# EAGLE design Arduino_MEGA_2560-Rev3 (EAGLE 6.5.0)
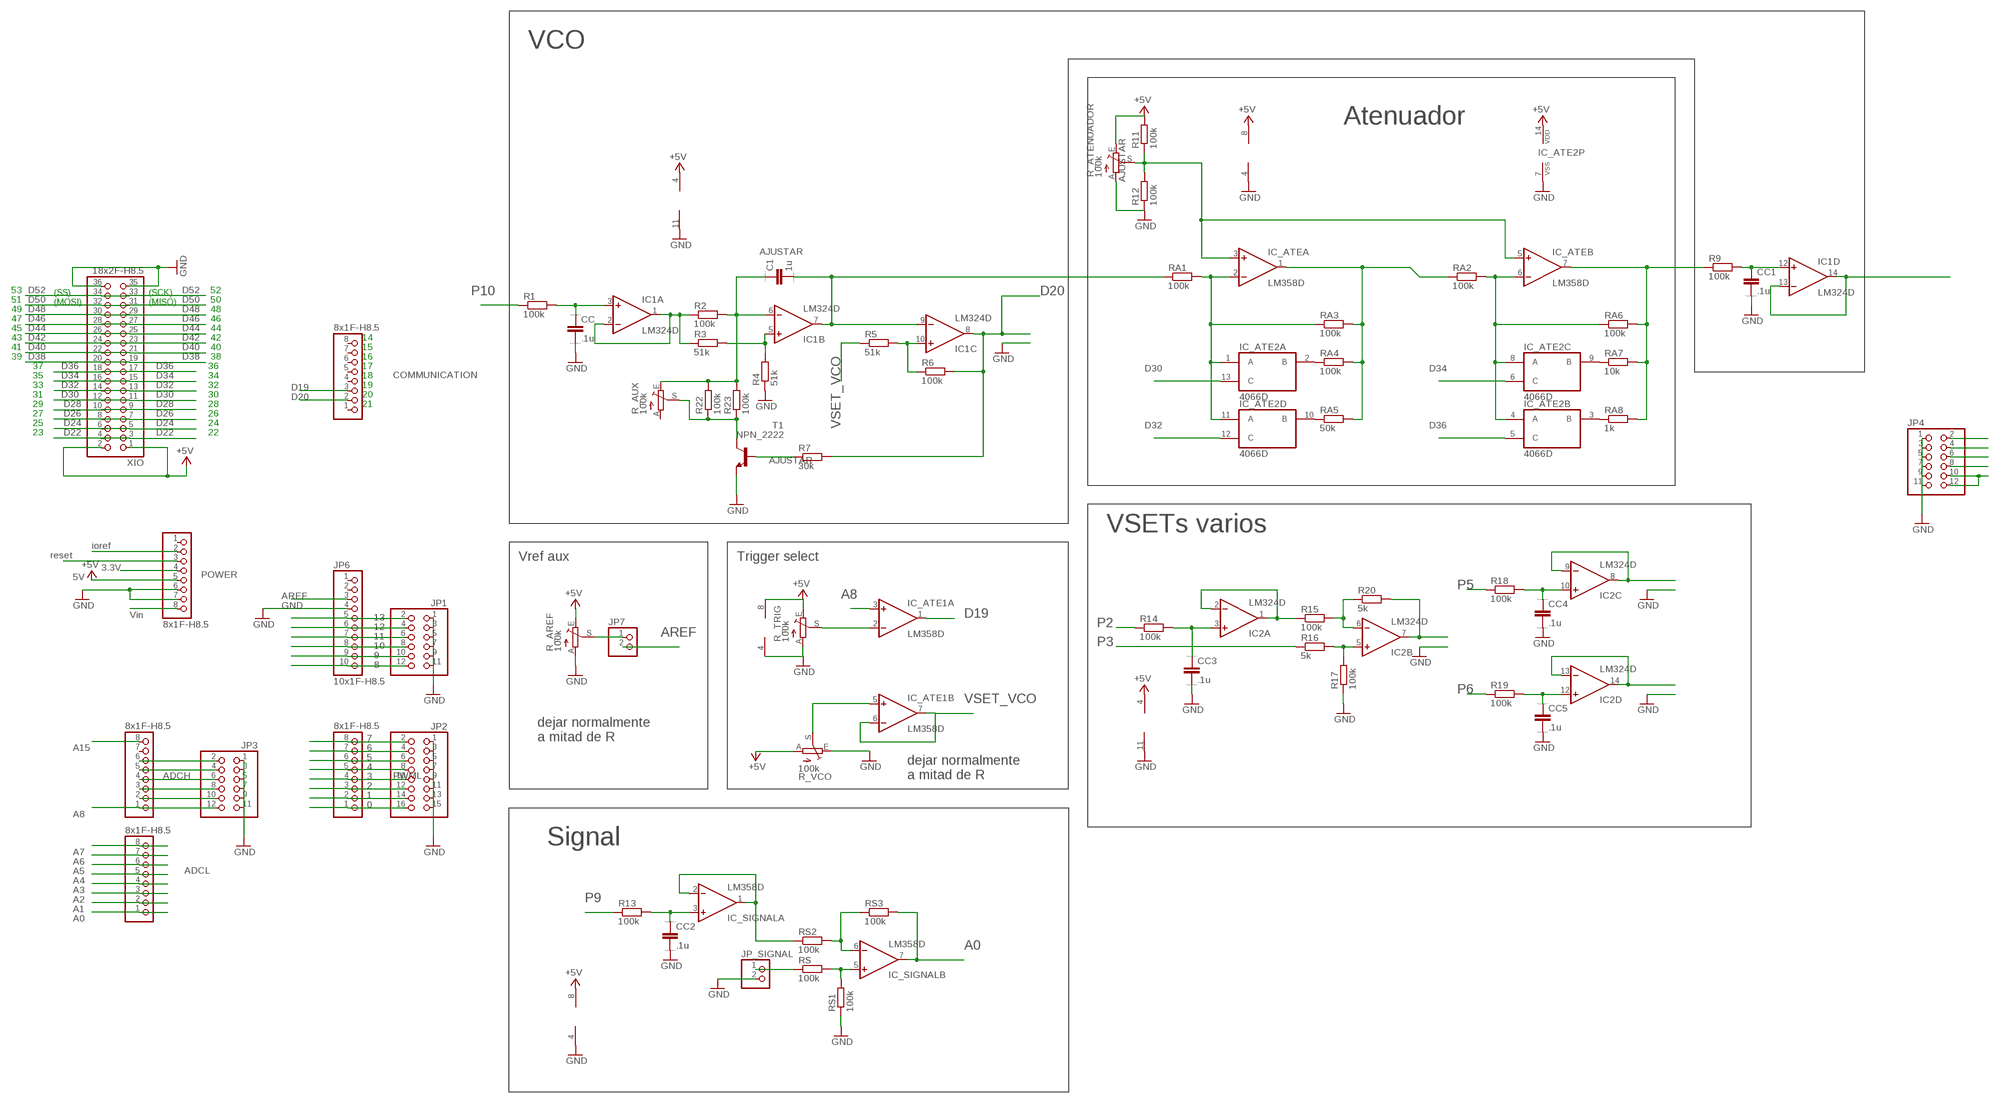
[diagram p0: schematic, sheet 1]

## Parts
ADCH  8x1F-H8.5  PINHD-1X8  [1X08]
ADCL  8x1F-H8.5  PINHD-1X8  [1X08]
C1  1u  CC1812  [C1812]
CC  .1u  CC1812  [C1812]
CC1  .1u  CC1812  [C1812]
CC2  .1u  CC1812  [C1812]
CC3  .1u  CC1812  [C1812]
CC4  .1u  CC1812  [C1812]
CC5  .1u  CC1812  [C1812]
COMMUNICATION  8x1F-H8.5  PINHD-1X8  [1X08]
IC1  LM324D  [SO14]
IC2  LM324D  [SO14]
IC_ATE  LM358D  [SO08]
IC_ATE1  LM358D  [SO08]
IC_ATE2  4066D  [SO14]
IC_SIGNAL  LM358D  [SO08]
JP1  PINHD-2X6  [2X06]
JP2  PINHD-2X8  [2X08]
JP3  PINHD-2X6  [2X06]
JP4  PINHD-2X6  [2X06]
JP6  10x1F-H8.5  PINHD-1X10_ARD  [1X10]
JP7  PINHD-1X2  [1X02]
JP_SIGNAL  PINHD-1X2  [1X02]
POWER  8x1F-H8.5  PINHD-1X8  [1X08]
PWML  8x1F-H8.5  PINHD-1X8  [1X08]
R1  100k  R-EU_R1206  [R1206]
R2  100k  R-EU_R1206  [R1206]
R3  51k  R-EU_R1206  [R1206]
R4  51k  R-EU_R1206  [R1206]
R5  51k  R-EU_R1206  [R1206]
R6  100k  R-EU_R1206  [R1206]
R7  30k  R-EU_0204/7  [0204/7]
R9  100k  R-EU_R1206  [R1206]
R11  100k  R-EU_R1206  [R1206]
R12  100k  R-EU_R1206  [R1206]
R13  100k  R-EU_R1206  [R1206]
R14  100k  R-EU_R1206  [R1206]
R15  100k  R-EU_R1206  [R1206]
R16  5k  R-EU_R1206  [R1206]
R17  100k  R-EU_R1206  [R1206]
R18  100k  R-EU_R1206  [R1206]
R19  100k  R-EU_R1206  [R1206]
R20  5k  R-EU_R1206  [R1206]
R22  100k  R-EU_R1206  [R1206]
R23  100k  R-EU_R1206  [R1206]
R_AREF  100k  TRIM_EU-B64Y  [B64Y]
R_ATENUADOR  100k  TRIM_EU-B64Y  [B64Y]
R_AUX  100k  TRIM_EU-B64Y  [B64Y]
R_TRIG  100k  TRIM_EU-B64Y  [B64Y]
R_VCO  100k  TRIM_EU-B64Y  [B64Y]
RA1  100k  R-EU_R1206  [R1206]
RA2  100k  R-EU_R1206  [R1206]
RA3  100k  R-EU_R1206  [R1206]
RA4  100k  R-EU_R1206  [R1206]
RA5  50k  R-EU_R1206  [R1206]
RA6  100k  R-EU_R1206  [R1206]
RA7  10k  R-EU_0204/7  [0204/7]
RA8  1k  R-EU_0204/7  [0204/7]
RS  100k  R-EU_R1206  [R1206]
RS1  100k  R-EU_R1206  [R1206]
RS2  100k  R-EU_R1206  [R1206]
RS3  100k  R-EU_R1206  [R1206]
T1  NPN_2222  NPN_SUP  [TO19_SUP]
XIO  18x2F-H8.5  PINHD-2X18  [2X18]

## Nets
3V3: POWER.4
+5V [power usb]: IC1.4(P:V+) IC2.4(P:V+) IC_ATE1.8(P:V+) IC_ATE2.14(P:VDD) IC_ATE.8(P:V+) IC_SIGNAL.8(P:V+) POWER.5 R11.2 R_AREF.E R_ATENUADOR.E R_TRIG.E R_VCO.A XIO.1 XIO.2
A0: ADCL.1 IC_SIGNAL.7(B:OUT) RS3.2
A1: ADCL.2
A2: ADCL.3
A3: ADCL.4
A4: ADCL.5
A5: ADCL.6
A6: ADCL.7
A7: ADCL.8
A8: ADCH.1 IC_ATE1.3(A:+IN) JP3.12
A9: ADCH.2 JP3.10
A9BIS: IC_ATE1.5(B:+IN) R_VCO.S
A10: ADCH.3 JP3.8
A11: ADCH.4 JP3.6
A12: ADCH.5 JP3.4
A13: ADCH.6 JP3.2
A15: ADCH.8
AREF: JP6.3 JP7.2
D19: COMMUNICATION.3 IC_ATE1.1(A:OUT)
D20: COMMUNICATION.2 IC1.8(C:OUT) JP4.2 R6.2 R7.2
D22: XIO.3 XIO.4
D24: XIO.5 XIO.6
D26: XIO.7 XIO.8
D28: XIO.9 XIO.10
D30: IC_ATE2.13(A:C) XIO.11 XIO.12
D32: IC_ATE2.12(D:C) XIO.13 XIO.14
D34: IC_ATE2.6(C:C) XIO.15 XIO.16
D36: IC_ATE2.5(B:C) XIO.17 XIO.18
D38: XIO.19 XIO.20
D40: XIO.21 XIO.22
D42: XIO.23 XIO.24
D44: XIO.25 XIO.26
D46: XIO.27 XIO.28
D48: XIO.29 XIO.30
D50: XIO.31 XIO.32
D52: XIO.33 XIO.34
GND [gnd]: CC1.2 CC2.2 CC3.2 CC4.2 CC5.2 CC.2 IC1.11(P:V-) IC2.11(P:V-) IC_ATE1.4(P:V-) IC_ATE2.7(P:VSS) IC_ATE.4(P:V-) IC_SIGNAL.4(P:V-) JP1.1 JP1.3 JP1.5 JP1.7 JP1.9 JP1.11 JP2.1 JP2.3 JP2.5 JP2.7 JP2.9 JP2.11 JP2.13 JP2.15 JP3.1 JP3.3 JP3.5 JP3.7 JP3.9 JP3.11 JP4.1 JP4.3 JP4.5 JP4.7 JP4.9 JP4.11 JP6.4 JP_SIGNAL.2 POWER.6 POWER.7 R4.1 R12.1 R17.1 R_AREF.A R_ATENUADOR.A R_TRIG.A R_VCO.E RS1.1 T1.3(E) XIO.35 XIO.36
N$1: POWER.3
N$2: POWER.2
N$4: IC_ATE1.2(A:-IN) R_TRIG.S
N$5: CC.1 IC1.3(A:+IN) R1.2
N$6: IC1.1(A:OUT) IC1.2(A:-IN) R2.1 R3.1
N$7: IC_ATE2.1(A:A) IC_ATE2.11(D:A) IC_ATE.2(A:-IN) RA1.2 RA3.1
N$8: C1.1 IC1.6(B:-IN) R2.2 R22.2 R23.2 R_AUX.E
N$9: IC_ATE2.3(B:B) RA8.1
N$10: IC1.5(B:+IN) R3.2 R4.2
N$11: IC1.10(C:+IN) R5.2 R6.1
N$12: IC_ATE2.10(D:B) RA5.1
N$13: R7.1 T1.2(B)
N$14: CC1.1 IC1.12(D:+IN) R9.2
N$15: IC_SIGNAL.1(A:OUT) IC_SIGNAL.2(A:-IN) RS2.1
N$17: IC_ATE2.4(B:A) IC_ATE2.8(C:A) IC_ATE.6(B:-IN) RA2.2 RA6.1
N$18: IC_ATE.1(A:OUT) RA2.1 RA3.2 RA4.2 RA5.2
N$19: IC_ATE2.2(A:B) RA4.1
N$20 [gnd]: IC_SIGNAL.5(B:+IN) RS1.2 RS.2
N$21: IC_SIGNAL.6(B:-IN) RS2.2 RS3.1
N$22: CC3.1 IC2.3(A:+IN) R14.2
N$23: IC_ATE2.9(C:B) RA7.1
N$24: IC2.1(A:OUT) IC2.2(A:-IN) R15.1
N$25: CC2.1 IC_SIGNAL.3(A:+IN) R13.2
N$26: IC2.6(B:-IN) R15.2 R20.1
N$27: IC_ATE.7(B:OUT) R9.1 RA6.2 RA7.2 RA8.2
N$28: IC_ATE.3(A:+IN) IC_ATE.5(B:+IN) R11.1 R12.2 R_ATENUADOR.S
N$29: IC2.5(B:+IN) R16.2 R17.2
N$30: CC5.1 IC2.12(D:+IN) R19.2
N$31: CC4.1 IC2.10(C:+IN) R18.2
N$35: R22.1 R23.1 R_AUX.S T1.1(C)
N$36: JP7.1 R_AREF.S
P0: JP2.16 PWML.1
P1: JP2.14 PWML.2
P2: JP2.12 PWML.3 R14.1
P3: JP2.10 PWML.4 R16.1
P4: JP2.8 PWML.5
P5: JP2.6 PWML.6 R18.1
P6: JP2.4 PWML.7 R19.1
P7: JP2.2 PWML.8
P8: JP1.12 JP6.10
P9: JP1.10 JP6.9 R13.1
P10: JP1.8 JP6.8 R1.1
P11: JP1.6 JP6.7
P12: JP1.4 JP6.6
P13: JP1.2 JP6.5
SIGNAL: JP_SIGNAL.1 RS.1
SP5: IC2.8(C:OUT) IC2.9(C:-IN) JP4.4
SP6: IC2.13(D:-IN) IC2.14(D:OUT) JP4.6
SPSUPER: IC2.7(B:OUT) JP4.8 R20.2
TRIANG_ATE: IC1.13(D:-IN) IC1.14(D:OUT) JP4.10 JP4.12
TRIANGULAR: C1.2 IC1.7(B:OUT) IC1.9(C:-IN) RA1.1
VIN: POWER.8
VSET_VCO: IC_ATE1.6(B:-IN) IC_ATE1.7(B:OUT) R5.1
Unconnected: ADCH.7 COMMUNICATION.1 COMMUNICATION.4 COMMUNICATION.5 COMMUNICATION.6 COMMUNICATION.7 COMMUNICATION.8 JP6.1 JP6.2 POWER.1 R_AUX.A

## Notes on the sheet
- VCO
- Atenuador
- AJUSTAR
- AJUSTAR
- 53 | (SS) | (SCK) | 52
- 51 | (MOSI) | (MISO) | 50
- 49 | 48
- 47 | 46
- 45 | 44
- 43 | 42 | 14
- 41 | 40 | 15
- 39 | 38 | 16
- 37 | 36 | 17
- 35 | 34 | 18
- 33 | 32 | 19
- 31 | 30 | 20
- 29 | 28 | 21
- 27 | 26
- 25 | 24
- 23 | 22
- AJUSTAR
- VSETs varios
- ioref
- reset
- Vref aux | Trigger select
- 3.3V
- 5V
- P5
- Vin | 13
- 12 | P2
- 11
- 10 | P3
- 9
- 8
- P6
- 7
- dejar normalmente
  a mitad de R
- A15 | 6
- 5
- 4
- 3
- dejar normalmente
  a mitad de R
- 2
- 1
- 0
- A8
- Signal
- A7
- A6
- A5
- A4
- A3
- A2 | P9
- A1
- A0
- A0

## Library data of the parts
ADCH ADCL COMMUNICATION POWER PWML = SmartPrj:PINHD-1X8: PIN HEADER
C1 CC CC1-CC5 = eagle-ltspice:C: CAPACITOR, European symbol; SPICEMODEL: NONE; SPICEPREFIX: C
IC1 IC2 = linear:LM324: OP AMP
IC_ATE IC_ATE1 IC_SIGNAL = linear:LM358: OP AMP also LM158; LM258; LM2904 Source: http://cache.national.com/ds/LM/LM158.pdf
IC_ATE2 = 40xx:4066: Quad bilateral ANALOG SWITCH
JP1 JP3 JP4 = pinhead:PINHD-2X6: PIN HEADER
JP2 = pinhead:PINHD-2X8: PIN HEADER
JP6 = SmartPrj:PINHD-1X10_ARD: PIN HEADER
JP7 JP_SIGNAL = pinhead:PINHD-1X2: PIN HEADER
R1-R7 R9 R11-R20 R22 R23 RA1-RA8 RS RS1-RS3 = rcl:R-EU_: RESISTOR, European symbol
R_AREF R_ATENUADOR R_AUX R_TRIG R_VCO = pot:TRIM_EU-: POTENTIOMETER
T1 = 00_Lolo:NPN_SUP
XIO = SmartPrj:PINHD-2X18: PIN HEADER

## Net classes
0 default: width 0.203 mm, drill 0.406 mm, clearance 0.203 mm
1 power: width 0.61 mm, drill 0.406 mm, clearance 0.203 mm
2 gnd: width 0.305 mm, drill 0.406 mm, clearance 0.203 mm
3 power usb: width 0.508 mm, drill 0.406 mm, clearance 0.203 mm

## Board
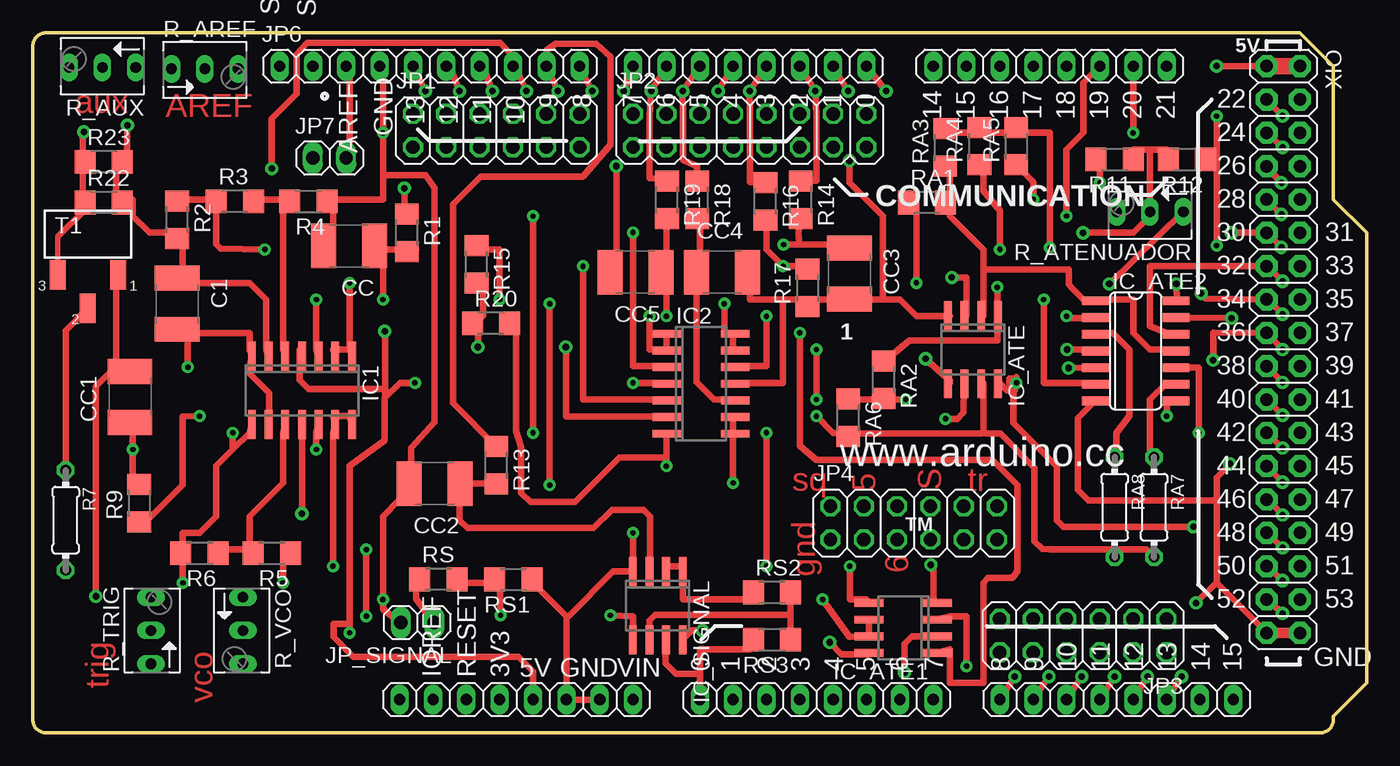
[diagram p1: board, top side]
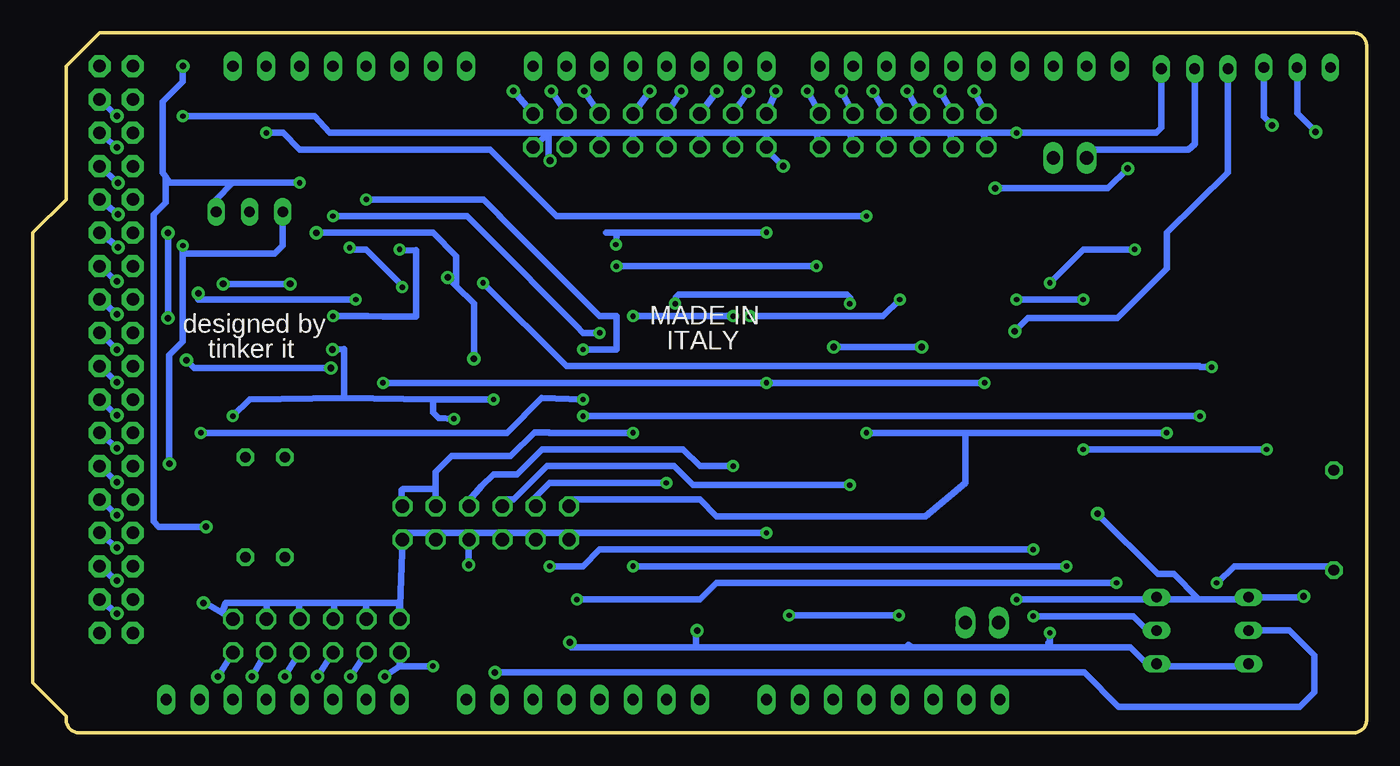
[diagram p2: board, bottom side, seen from below]

Size 101.6 x 53.34 mm. Coordinates in mm from the lower left corner, seen from the top.
Outline: 96.52,53.34 99.06,50.8 99.06,40.64 101.6,38.1 101.6,3.81 99.06,1.27 99.06,1 arc-90 98.06,0 1,0 arc-90 0,1 0,52.34 arc-90 1,53.34 96.52,53.34
Copper layers (1*16): Top 0.035mm / dielectric 1.5mm / Bottom 0.035mm
Design rules "default *": minimum track width 0.5mm, minimum drill 16mil, track to track 7mil, track to pad 7mil, pad to pad 8mil, via to via 10mil, smd to smd 7mil, copper to edge 27mil, drill to drill 12mil, minimum pad ring 10mil, minimum via ring 10mil, stop-mask expansion 2mil, vias tented up to drill 24mil, thermal gap 10mil

### Footprints (pad centres in the part's own frame; a part is rotated, then mirrored left to right if it is on the bottom)
1X08 = drill 0.85 pad 1.422 long: 1 -8.89,0; 2 -6.35,0; 3 -3.81,0; 4 -1.27,0; 5 1.27,0; 6 3.81,0; 7 6.35,0; 8 8.89,0
C1812 = smd 1.9 x 3.4: 1 -1.95,0; 2 1.95,0
SO14 = smd 0.6 x 2.2: 1 -3.81,-2.6; 2 -2.54,-2.6; 3 -1.27,-2.6; 4 0,-2.6; 5 1.27,-2.6; 6 2.54,-2.6; 7 3.81,-2.6; 8 3.81,2.6; 9 2.54,2.6; 10 1.27,2.6; 11 0,2.6; 12 -1.27,2.6; 13 -2.54,2.6; 14 -3.81,2.6
SO08 = smd 0.6 x 2.2: 1 -1.905,-2.6; 2 -0.635,-2.6; 3 0.635,-2.6; 4 1.905,-2.6; 5 1.905,2.6; 6 0.635,2.6; 7 -0.635,2.6; 8 -1.905,2.6
SO14' = smd 0.66 x 2.032: 1 -3.81,-3.073; 2 -2.54,-3.073; 3 -1.27,-3.073; 4 0,-3.073; 5 1.27,-3.073; 6 2.54,-3.073; 7 3.81,-3.073; 8 3.81,3.073; 9 2.54,3.073; 10 1.27,3.073; 11 0,3.073; 12 -1.27,3.073; 13 -2.54,3.073; 14 -3.81,3.073
2X06 = drill 1.016 octagon: 1 -6.35,-1.27; 2 -6.35,1.27; 3 -3.81,-1.27; 4 -3.81,1.27; 5 -1.27,-1.27; 6 -1.27,1.27; 7 1.27,-1.27; 8 1.27,1.27; 9 3.81,-1.27; 10 3.81,1.27; 11 6.35,-1.27; 12 6.35,1.27
2X08 = drill 1.016 octagon: 1 -8.89,-1.27; 2 -8.89,1.27; 3 -6.35,-1.27; 4 -6.35,1.27; 5 -3.81,-1.27; 6 -3.81,1.27; 7 -1.27,-1.27; 8 -1.27,1.27; 9 1.27,-1.27; 10 1.27,1.27; 11 3.81,-1.27; 12 3.81,1.27; 13 6.35,-1.27; 14 6.35,1.27; 15 8.89,-1.27; 16 8.89,1.27
1X10 = drill 0.85 pad 1.422 long: 1 -11.43,0; 2 -8.89,0; 3 -6.35,0; 4 -3.81,0; 5 -1.27,0; 6 1.27,0; 7 3.81,0; 8 6.35,0; 9 8.89,0; 10 11.43,0
1X02 = drill 1.016 long: 1 -1.27,0; 2 1.27,0
R1206 = smd 1.6 x 1.803: 1 -1.422,0; 2 1.422,0
0204/7 = drill 0.813 octagon: 1 -3.81,0; 2 3.81,0
B64Y = drill 0.813 long: A 2.54,0; E -2.54,0; S 0,0
TO19_SUP = smd 1.219 x 2.235: 1 -2.311,-3.099; 2 0,-5.639; 3 2.311,-3.099
2X18 = drill 0.95 pad 1.676 octagon: 1 -21.59,-1.27; 2 -21.59,1.27; 3 -19.05,-1.27; 4 -19.05,1.27; 5 -16.51,-1.27; 6 -16.51,1.27; 7 -13.97,-1.27; 8 -13.97,1.27; 9 -11.43,-1.27; 10 -11.43,1.27; 11 -8.89,-1.27; 12 -8.89,1.27; 13 -6.35,-1.27; 14 -6.35,1.27; 15 -3.81,-1.27; 16 -3.81,1.27; 17 -1.27,-1.27; 18 -1.27,1.27; 19 1.27,-1.27; 20 1.27,1.27; 21 3.81,-1.27; 22 3.81,1.27; 23 6.35,-1.27; 24 6.35,1.27; 25 8.89,-1.27; 26 8.89,1.27; 27 11.43,-1.27; 28 11.43,1.27; 29 13.97,-1.27; 30 13.97,1.27; 31 16.51,-1.27; 32 16.51,1.27; 33 19.05,-1.27; 34 19.05,1.27; 35 21.59,-1.27; 36 21.59,1.27

### Placement (x,y rotation side)
ADCH  82.55,2.54 0 top
ADCL  59.69,2.54 0 top
C1  11,32.7 270 top
CC  24.1,37.1 180 top
CC1  7.4,25.6 90 top
CC2  30.6,19 180 top
CC3  62.2,35 270 top
CC4  52.5,35.1 0 top
CC5  45.9,35.1 180 top
COMMUNICATION  77.47,50.8 180 top
IC1  20.5,26.1 180 top
IC2  50.9,26.6 270 top
IC_ATE  71.6,29.2 180 top
IC_ATE1  66.3,8 90 top
IC_ATE2  4066D  [SO14']  84,29.1 270 top
IC_SIGNAL  47.6,9.7 180 top
JP1  35.3,45.9 0 top
JP2  54.61,45.9 0 top
JP3  80,7.4 180 top
JP4  67.1,16 0 top
JP6  30.23,50.8 0 top
JP7  22.6,43.8 0 top
JP_SIGNAL  29.3,8.4 180 top
POWER  36.83,2.54 0 top
PWML  54.61,50.8 180 top
R1  28.5,38.1 270 top
R2  11,39.1 270 top
R3  15.4,40.5 0 top
R4  21,40.5 180 top
R5  18.2,13.7 180 top
R6  12.7,13.7 180 top
R7  2.5,16.2 270 top
R9  8.1,17.5 90 top
R11  82.4,43.7 180 top
R12  87.9,43.7 180 top
R13  35.3,20.4 270 top
R14  58.5,40.6 270 top
R15  33.8,35.7 270 top
R16  55.8,40.5 270 top
R17  59,33.9 90 top
R18  50.6,40.6 270 top
R19  48.3,40.6 270 top
R20  34.9,31.2 0 top
R22  5.4,40.4 0 top
R23  5.4,43.5 0 top
R_AREF  13.1,50.6 0 top
R_ATENUADOR  85.1,39.7 180 top
R_AUX  5.3,50.7 180 top
R_TRIG  9,7.8 90 top
R_VCO  16,7.8 270 top
RA1  68.1,40.4 0 top
RA2  64.8,26.9 270 top
RA3  69.5,44.6 90 top
RA4  72.1,44.7 90 top
RA5  74.9,44.7 90 top
RA6  62.1,24 270 top
RA7  85.4,17.2 270 top
RA8  82.4,17.2 270 top
RS  30.9,11.7 0 top
RS1  36.6,11.7 180 top
RS2  56.3,10.7 0 top
RS3  56.3,7.1 180 top
T1  4.2,38 0 top
XIO  95.25,29.21 270 top

### Tracks (layer width: path | path; a pad name or v marks a point on that pad's centre or on a via)
+5V  (via drill 0.41, 0.5)
  Top 0.5: IC_ATE1.8 63.6,6 61.6,6 v60.7,6.9 | IC_SIGNAL.8 50.2,7.8 v51,7.8 | POWER.5 38.1,4.7 37,5.8 24.4,5.8 22.9,7.3 22.9,8.3 24.13,8.3 | v26.8,30.6 26.85,30.55 26.85,26.4 | 26.85,26.4 26.85,25.55 | 20.32,29.21 20.32,26.88 21,26.2 26.65,26.2 26.85,26.4 | v74.93,26.67 74.7,26.44 74.7,23.6 78,20.3 78,16.2 78.5,15.7 v88.4,15.7 | v90.17,50.8 94.5,50.8 | 87.13,33.02 v87.1,34.2 | v82,34.2 R_ATENUADOR.E
  Top 0.508: 87.13,33.02 IC_ATE2.14 | 81.28,42.95 R11.2 81.28,43.18 81.28,42.95 | 20.32,29.21 IC1.4 | 81.28,42.95 v81.28,41.91 | v45.72,26.67 48.26,26.67 IC2.4 | v74.93,26.67 74.77,26.67 74.9,26.7 74.9,27.1 74.8,27 74.4,27 74.4,26.6 74.8,26.2 74.8,26.1 74.2,26.1 73.66,26.67 IC_ATE.8 | v24.13,7.62 24.13,8.3 24.13,20.32 26.8,22.29 26.8,25.5 26.85,25.55 27.97,26.67 v29.1,26.67
  Top 1.27: XIO.1 94.5,50.8 XIO.2
  Bottom 0.5: v60.7,6.9 60.6,6.8 60.6,6.5 51.1,6.5 | 51.1,6.5 34.6,6.5 | 34.6,6.5 24.13,6.5 18,6.5 16.76,5.26 R_VCO.A | v51,7.8 51.1,7.7 51.1,6.5 | 34.6,6.5 34.9,6.7 | 10.56,42.68 R_AREF.E | v26.8,30.6 25.8,31.6 19,31.6 15.24,35.36 15.24,38.1 | v90.17,50.8 90.2,50.77 90.2,49.6 91.7,48.1 91.7,42.7 91.26,42.02 91.19,41.91 86,41.91 | v88.4,15.7 92,15.7 92.4,16.1 92.4,39.5 91.49,40.41 91.49,41.91 91.49,42.37 | v87.1,34.2 v82,34.2
  Bottom 0.508: R_TRIG.E 8.89,5.08 15.24,5.08 R_VCO.A | 15.24,38.1 10.56,42.68 | v81.28,41.91 86,41.91 86.36,41.91 87.63,40.64 R_ATENUADOR.E | v29.1,26.67 v45.72,26.67 v74.93,26.67 | v24.13,7.62 24.13,6.5 24.23,6.85 | 91.26,42.02 91.44,41.91 91.49,41.91
A0
  Top 0.5: ADCL.1 50.8,4.5 | RS3.2 54.61,6.35 50.8,6.35 50.8,4.5 | 50.8,4.5 49,4.5 48.2,5.3 48.2,7.07 IC_SIGNAL.7
A8  (via drill 0.41, 0.5)
  Top 0.5: v71.12,5.08 71.12,8.89 69.85,8.89 IC_ATE1.3 | ADCH.1 v74.8,4.3
  Bottom 0.5: 73.66,5.08 v71.12,5.08 | 73.66,5.08 JP3.12 | v74.8,4.3 73.66,5.08
A9  (via drill 0.5)
  Top 0.5: ADCH.2 v77.4,4.3
  Bottom 0.5: v77.4,4.3 JP3.10
A9BIS  (via drill 0.41)
  Top 0.5: v62.23,12.7 62.23,10.16 63.5,10.16 IC_ATE1.5 | v25.4,8.89 v25.4,13.97
  Bottom 0.5: v62.23,12.7 59.69,12.7 58.42,13.97 v25.4,13.97 | v25.4,8.89 17.78,8.89 16.51,7.62 R_VCO.S
A10  (via drill 0.5)
  Top 0.5: ADCH.3 v79.9,4.3
  Bottom 0.5: v79.9,4.3 JP3.8
A11  (via drill 0.5)
  Top 0.5: ADCH.4 v82.4,4.3
  Bottom 0.5: v82.4,4.3 JP3.6
A12  (via drill 0.5)
  Top 0.5: ADCH.5 v84.9,4.3
  Bottom 0.5: v84.9,4.3 JP3.4
A13  (via drill 0.5)
  Top 0.5: ADCH.6 v87.5,4.3
  Bottom 0.5: v87.5,4.3 JP3.2
AREF
  Top 0.5: JP6.3 24.13,50.8 24.13,44.45 JP7.2
D19  (via drill 0.41)
  Top 0.5: COMMUNICATION.3 80.01,49.53 80.01,45.72 78.74,44.45 v78.74,39.37 | v58.42,30.48 58.42,21.88 59.7,20.8 73.1,20.8 75,18.9 75,12.3 74.6,11.8 72.76,11.8 72.39,11.43 72.39,3.81 69.85,3.81 69.85,6.35 IC_ATE1.1
  Bottom 0.5: v78.74,39.37 68.52,39.37 67.25,38.1 67.14,38 60.2,31 59.68,30.48 v58.42,30.48
D20  (via drill 0.41)
  Top 0.5: v11.43,11.43 11.43,13.97 | 15.24,21.59 13.97,20.32 13.97,16.51 12.7,15.24 11.43,15.24 11.43,13.97 | 15.24,21.59 16.51,22.86 IC1.8 | 11.43,13.97 R6.2 | v83.82,45.72 COMMUNICATION.2 | v38.1,22.86 v38.1,39.37 | 15.24,21.59 v15.24,22.86
  Bottom 0.5: v11.43,11.43 11.36,11.43 10.09,12.7 2.54,12.7 R7.2 | v83.82,45.72 82.55,45.72 81.28,44.45 66.77,44.45 61.69,39.37 v38.1,39.37 | v15.24,22.86 30.56,22.86 | 30.56,22.86 v38.1,22.86 | 30.56,22.86 30.56,19.05 33.6,16.51 49.53,16.51 50.8,17.78 60.96,17.78 JP4.2
D22  (via drill 0.5)
  Top 0.5: XIO.3 v95.2,47
  Bottom 0.5: v95.2,47 XIO.4
D24  (via drill 0.5)
  Top 0.5: XIO.5 v95.2,44.6
  Bottom 0.5: v95.2,44.6 XIO.6
D26  (via drill 0.5)
  Top 0.5: XIO.7 v95.1,41.9
  Bottom 0.5: v95.1,41.9 XIO.8
D28  (via drill 0.5)
  Top 0.5: XIO.9 v95.1,39.5
  Bottom 0.5: v95.1,39.5 XIO.10
D30  (via drill 0.5)
  Top 0.5: v91.3,38.1 XIO.11 v95.1,37 | v91.3,31.6 IC_ATE2.13
  Bottom 0.5: v91.3,38.1 v91.3,31.6 | v95.1,37 XIO.12
D32  (via drill 0.5)
  Top 0.5: IC_ATE2.12 86.36,30.48 85.09,30.98 85.09,35.56 XIO.13 v95.2,34.4
  Bottom 0.5: v95.2,34.4 XIO.14
D34  (via drill 0.41, 0.5)
  Top 0.5: v77,33.02 77,26.67 80.01,26.67 IC_ATE2.6 | v89,33.5 89,33.4 89.3,33.1 XIO.15 v95.2,31.9
  Bottom 0.5: v89,33.5 89,33 v77,33.02 | v95.2,31.9 XIO.16
D36  (via drill 0.5)
  Top 0.5: IC_ATE2.5 v78.9,27.8 | v89.9,28.4 89.9,30.5 XIO.17 v95.2,29.2
  Bottom 0.5: v78.9,27.8 89.3,27.8 v89.9,28.4 | v95.2,29.2 XIO.18
D38  (via drill 0.5)
  Top 0.5: XIO.19 v95.2,26.7
  Bottom 0.5: v95.2,26.7 XIO.20
D40  (via drill 0.5)
  Top 0.5: XIO.21 v95.2,24.2
  Bottom 0.5: v95.2,24.2 XIO.22
D42  (via drill 0.5)
  Top 0.5: XIO.23 v95.2,21.7
  Bottom 0.5: v95.2,21.7 XIO.24
D44  (via drill 0.5)
  Top 0.5: XIO.25 v95.2,19.1
  Bottom 0.5: v95.2,19.1 XIO.26
D46  (via drill 0.5)
  Top 0.5: XIO.27 v95.2,16.6
  Bottom 0.5: v95.2,16.6 XIO.28
D48  (via drill 0.5)
  Top 0.5: XIO.29 v95.2,14.1
  Bottom 0.5: v95.2,14.1 XIO.30
D50  (via drill 0.5)
  Top 0.5: XIO.31 v95.2,11.6
  Bottom 0.5: v95.2,11.6 XIO.32
D52  (via drill 0.5)
  Top 0.5: XIO.33 v95.2,9.1
  Bottom 0.5: v95.2,9.1 XIO.34
GND  (via drill 0.41, 0.5)
  Top 0.5: 40.64,8.89 38.1,11.43 RS1.1 | 40.64,8.89 POWER.6 POWER.7 | IC_ATE1.4 68.58,10.16 68.58,12.62 v68.4,12.8 | v45.72,15.24 45.72,12.7 IC_SIGNAL.4 44.2,12.3 40.79,8.89 40.64,8.89 | T1.3 6.35,34.29 6.35,27.94 CC1.2 7.35,27.5 5.9,27.5 4.8,26.4 v4.8,10.4 | JP_SIGNAL.2 26.67,9.42 v26.67,10.16 26.67,16.51 27.94,17.78 CC2.2 29.21,19.05 28.8,19.46 28.8,21.7 30.6,23.7 30.6,41.5 29.9,42.5 26.67,42.5 | v44.45,43.18 44.45,35.56 CC5.2 | 64.77,33.02 62.23,33.02 CC3.2 60.96,33.02 59.69,33.02 R17.1 58.42,33.02 57.15,33.02 | 64.77,33.02 66.04,33.02 67.31,31.75 69.85,31.75 IC_ATE.4 | 57.15,33.02 54.61,33.02 54.61,34.29 CC4.2 | 57.15,33.02 57.15,26.67 53.34,26.67 IC2.11 | 64.77,33.02 64.77,39.37 62.2,41.94 v62.2,43.6 | 90.17,11.43 XIO.35 | 90.17,17.7 90.17,11.43 | 88.9,43.18 R12.1 90.17,43.7 | 22.86,40.64 22.86,36.83 CC.2 | JP6.4 26.67,50.8 v26.67,45.72 26.67,42.5 | 22.86,40.64 26.67,40.64 26.67,42.5 | 22.86,40.64 R4.1 | IC1.11 v20.5,16.7 | v90.17,46.99 90.17,43.7 | 90.17,43.7 v90.17,37.13 | IC_ATE2.7 80.89,25.29 79.6,24 79.6,18.5 80.4,17.7 90.17,17.7 | 90.17,11.43 90.13,11.43 v88.6,9.9 | v91.2,20.5 90.17,19.47 90.17,17.7
  Top 0.813: XIO.35 XIO.36
  Bottom 0.5: 63.5,15.24 60.96,15.24 | 63.5,15.24 66.04,15.24 | 63.5,15.24 JP4.3 | 68.58,15.24 71.12,15.24 | 71.12,15.24 73.66,15.24 JP4.11 JP3.11 73.7,9.9 76.2,9.9 | 71.12,15.24 JP4.9 | 68.58,15.24 66.04,15.24 | 66.04,15.24 JP4.5 | 68.58,15.24 JP4.7 68.4,14.7 v68.4,12.8 | 60.96,15.24 v45.72,15.24 | 60.96,15.24 JP4.1 | 12.9,10.16 15.24,10.16 R_VCO.E 16.51,10.16 v26.67,10.16 | 12.9,10.16 8.89,10.16 R_TRIG.A 4.86,10.34 v4.8,10.4 | 60.96,45.72 62.3,45.72 | 62.3,45.72 78.98,45.72 80.15,46.99 v90.17,46.99 | 50.8,45.72 48.26,45.72 | 50.8,45.72 53.34,45.72 | 50.8,45.72 JP2.5 | 53.34,45.72 55.88,45.72 | 53.34,45.72 JP2.7 | 55.88,45.72 58.42,45.72 | 55.88,45.72 JP2.9 | 58.42,45.72 60.96,45.72 | 58.42,45.72 JP2.11 | 34.29,45.72 31.75,45.72 | 39.37,45.72 36.83,45.72 | 39.37,45.72 41.91,45.72 | 39.37,45.72 JP1.9 | 36.83,45.72 34.29,45.72 | 34.29,45.72 JP1.5 | 36.83,45.72 JP1.7 | 48.26,45.72 45.72,45.72 | 45.72,45.72 41.91,45.72 | 41.91,45.72 JP1.11 | 29.21,45.72 v26.67,45.72 16.04,45.72 15.64,46.12 R_AREF.A | 29.21,45.72 31.75,45.72 | 31.75,45.72 JP1.3 | 29.21,45.72 JP1.1 | 48.26,45.72 JP2.3 | 60.96,45.72 JP2.13 | v20.5,16.7 15.9,12.1 14.7,12.1 12.9,10.3 12.9,10.16 | R_ATENUADOR.A 82.56,37.13 83.19,36.5 90.17,36.5 | v88.6,9.9 88.48,9.9 87.17,9.14 | 87.17,9.14 JP3.1 | v44.45,43.18 45.71,44.44 JP2.1 45.72,45.72 | v62.2,43.6 62.3,43.7 62.3,45.72 | 62.3,45.72 62.39,45.63 JP2.15 | 76.2,9.9 78.6,9.9 | 78.6,9.9 81.3,9.9 | 81.3,9.9 83.8,9.9 | 83.8,9.9 86.9,9.9 87.17,9.14 | JP3.9 76.2,9.9 | JP3.7 78.6,9.9 | JP3.5 81.3,9.9 | JP3.3 83.8,9.9 | v90.17,37.13 90.17,36.5 | 90.17,36.5 90.2,29.8 91.2,28.8 v91.2,20.5
N$4  (via drill 0.5)
  Top 0.5: IC_ATE1.2 66.97,7.37 66.4,6.8 v66.4,4.6
  Bottom 0.5: v66.4,4.6 21.5,4.6 18.9,2 5.1,2 4,3.1 4,5.9 5.9,7.8 R_TRIG.S
N$5  (via drill 0.41)
  Top 0.5: R1.2 29.21,36.83 26.67,36.83 CC.1 26.67,35.56 v26.67,33.02 | v21.59,33.02 21.59,29.21 IC1.3
  Bottom 0.5: v26.67,33.02 v21.59,33.02
N$6  (via drill 0.41)
  Top 0.5: 24.13,29.21 22.86,29.21 IC1.2 | 13.97,40.64 11.43,40.64 R2.1 | v24.13,34.29 24.13,29.21 | 13.97,40.64 13.97,37.23 14.3,36.9 v17.67,36.83 | 24.13,29.21 IC1.1 | 13.97,40.64 R3.1
  Bottom 0.5: v24.13,34.29 21.59,36.83 v17.67,36.83
N$7
  Top 0.5: IC_ATE2.11 86.36,29.21 85.09,29.21 83.82,30.48 83.82,33.02 81.28,33.02 IC_ATE2.1 80.01,33.02 79.1,33.93 78.9,34.2 78.9,35.3 72.39,35.3 | 69.85,40.64 69.85,43.18 RA3.1 | 72.39,35.3 72.39,36.83 69.85,39.37 69.85,40.64 | 72.39,35.3 72.39,31.75 IC_ATE.2 | 69.85,40.64 RA1.2
N$8  (via drill 0.5)
  Top 0.5: IC1.6 17.78,29.21 17.78,33.02 16.51,34.29 11.43,34.29 C1.1 11.43,35.56 11.43,38.1 R2.2 10.16,38.1 8.89,38.1 7.62,39.37 7.62,40.64 R22.2 6.35,40.64 6.35,43.18 R23.2 7.2,43.88 v7.2,46.3
  Bottom 0.5: v7.2,46.3 7.84,46.94 R_AUX.E
N$9
  Top 0.5: IC_ATE2.3 81.28,30.48 82.25,30.48 83.52,29.21 83.52,24.13 82.55,22.86 82.55,21.59 RA8.1
N$10
  Top 0.5: 19.05,40.64 19.05,29.21 IC1.5 | 19.05,40.64 16.51,40.64 R3.2 | 19.05,40.64 R4.2
N$11
  Top 0.5: 16.51,13.97 13.97,13.97 R6.1 | 16.51,13.97 16.51,16.51 19.05,19.05 19.05,22.86 IC1.10 | 16.51,13.97 R5.2
N$12  (via drill 0.41)
  Top 0.5: RA5.1 76.1,42.08 76.2,41.91 v76.2,40.64 | v88.8,22.86 88.8,27.8 88.77,27.83 IC_ATE2.10 | v59.69,25.4 v59.69,29.21
  Bottom 0.5: v76.2,40.64 67.28,40.64 66.01,39.37 66.04,39.37 58.42,31.75 57.15,31.75 57.15,29.21 v59.69,29.21 | v59.69,25.4 62.86,25.5 64.13,24.23 64.2,24.13 65.47,22.86 v88.8,22.86
N$13
  Top 0.5: T1.2 2.5,30.66 R7.1
N$14  (via drill 0.41)
  Top 0.5: CC1.1 7.62,22.86 v7.62,21.59 7.62,19.05 R9.2 | v21.59,21.59 21.59,22.86 IC1.12
  Bottom 0.5: v7.62,21.59 v21.59,21.59
N$15
  Top 0.5: IC_SIGNAL.2 48.26,12.7 49.53,12.7 IC_SIGNAL.1 49.53,11.43 49.53,10.16 54.61,10.16 RS2.1
N$17  (via drill 0.41, 0.5)
  Top 0.5: 64.77,25.4 62.23,25.4 RA6.1 | v78.77,29.21 80.01,29.21 IC_ATE2.4 | 64.77,25.4 v66.51,25.4 | 64.77,25.4 RA2.2 | v86.36,24.13 86.36,25.4 IC_ATE2.8 | v69.52,23.93 70.43,23.93 70.9,24.4 70.92,26.27 IC_ATE.6
  Bottom 0.5: v66.51,25.4 71.12,25.4 | v86.36,24.13 85.09,25.4 77.9,25.5 | 71.12,25.4 77.9,25.5 | 71.12,25.4 71.12,24.42 70.7,24 v69.52,23.93 | v78.77,29.21 77.9,29.24 77.9,25.5
N$18  (via drill 0.41)
  Top 0.5: 72.39,45.72 69.85,45.72 RA3.2 | 72.39,45.72 74.93,45.72 | 72.39,45.72 RA4.2 | 73.46,31.75 73.46,29.91 66.78,29.91 64.81,28.24 64.77,27.94 RA2.1 | 74.93,45.72 77.47,45.72 v77.47,36.96 | 74.93,45.72 RA5.2 | 73.46,31.75 IC_ATE.1 | 73.46,31.75 v73.46,33.96
  Bottom 0.5: v73.46,33.96 73.66,34.29 76.2,36.83 77.47,36.83 v77.47,36.96
N$19  (via drill 0.41)
  Top 0.5: IC_ATE2.2 80.89,31.6 78.8,31.6 v78.74,31.75 | v73.66,36.83 73.66,39.8 72.39,41.31 72.4,41.3 72.39,43.18 RA4.1
  Bottom 0.5: v73.66,36.83 73.66,36.76 72.39,36.79 72.39,31.72 74.93,31.72 76.1,31.75 v78.74,31.75
N$20  (via drill 0.41)
  Top 0.5: 35.56,11.43 33.02,11.43 RS.2 | v43.99,8.96 45.72,8.89 45.72,7.62 IC_SIGNAL.5 | 35.56,11.43 v35.63,8.96 | 35.56,11.43 RS1.2
  Bottom 0.5: v35.63,8.96 v43.99,8.96
N$21
  Top 0.5: IC_SIGNAL.6 46.97,8.56 47.4,9 57.7,9 | 57.7,9 57.7,10.68 RS2.2 | 57.7,9 57.7,7.12 RS3.1
N$22  (via drill 0.41)
  Top 0.5: R14.2 58.42,39.37 58.32,38.02 58.4,37.2 | 60.96,36.83 CC3.1 60.95,37.2 58.4,37.2 | v45.72,38.13 45.72,27.94 48.26,27.94 IC2.3 | v57.19,37.2 58.4,37.2
  Bottom 0.5: 57.92,38.13 56.75,38.13 | 56.75,38.13 v45.72,38.13 | 56.75,38.13 57.15,38.1 v57.19,37.2
N$23
  Top 0.5: IC_ATE2.9 86.36,26.67 85.09,25.4 85.09,21.59 RA7.1
N$24  (via drill 0.41)
  Top 0.5: 48.26,29.21 48.26,30.48 IC2.1 | v35.56,33.02 35.56,36.83 34.29,36.83 R15.1 | v46.99,31.75 46.99,29.21 48.26,29.21 | 48.26,29.21 IC2.2
  Bottom 0.5: v35.56,33.02 36.83,31.75 v46.99,31.75
N$25
  Top 0.5: IC_SIGNAL.3 47,12.34 47,16.5 46.5,17 44.1,17 42.7,15.6 33.1,15.6 32.5,16.2 32.5,18.95 CC2.1 35.28,19 R13.2
N$26  (via drill 0.5)
  Top 0.5: R15.2 34.29,34.29 34.29,31.75 R20.1 33.9,31.3 v33.9,29.4 | IC2.6 48.26,24.1 40.6,24.1 v40.6,29.4
  Bottom 0.5: v40.6,29.4 v33.9,29.4
N$27  (via drill 0.41)
  Top 0.5: v12.7,24.13 11.4,24.11 11.4,18.9 9.01,16.51 8.89,16.51 R9.1 | v59.69,24.13 60.96,22.86 62.23,22.86 | 72.39,23 72.39,22.89 72.3,22.8 62.56,22.8 62.5,22.86 | 72.39,23 72.39,26.67 IC_ATE.7 | 62.23,22.86 62.5,22.86 | 62.23,22.86 RA6.2 | 62.5,22.86 62.5,22.8 62.3,22.6 62.3,22.7 62.4,22.8 | 72.39,23 72.59,22.8 73.7,22.8 76.3,20.2 76.3,14.6 76.9,14 77.47,13.97 82.2,13.97 | 82.2,13.97 84.82,13.97 RA7.2 | RA8.2 82.4,13.77 82.2,13.97
  Bottom 0.5: v59.69,24.13 v12.7,24.13
N$28  (via drill 0.5)
  Top 0.5: 85.09,44.45 83.82,44.45 R11.1 | 85.09,44.45 86.36,44.45 R12.2 | 85.09,44.45 85.09,40.64 R_ATENUADOR.S 85.09,39.37 83.82,38.1 v80,38.1 | IC_ATE.5 69.85,26.67 69.85,26.85 v68,28.5 | IC_ATE.3 71.12,31.75 71.12,34.7 v70,34.7
  Bottom 0.5: v68,28.5 68,32.7 69.35,34.05 | 69.35,34.05 v70,34.7 | v80,38.1 71.12,38.1 69.35,36.33 69.35,34.05
N$29  (via drill 0.41)
  Top 0.5: R16.2 55.88,39.37 55.88,36.83 v57.15,35.56 58.42,35.56 R17.2 | v41.91,35.56 41.91,30.26 41.9,30.25 41.9,25.4 48.26,25.4 IC2.5
  Bottom 0.5: v57.15,35.56 v41.91,35.56
N$30  (via drill 0.41)
  Top 0.5: R19.2 48.26,39.37 48.26,35.56 CC5.1 48.26,34.29 v48.26,31.75 | v55.88,31.75 55.88,27.94 53.34,27.94 IC2.12
  Bottom 0.5: v48.26,31.75 v55.88,31.75
N$31
  Top 0.5: R18.2 50.8,39.37 50.8,35.56 CC4.1 50.55,26.75 51.9,25.4 53.43,25.4 IC2.10
N$35  (via drill 0.5)
  Top 0.406: R22.1 3.98,39.88 1.9,37.8 1.9,34.91 T1.1
  Top 0.5: 3.81,43.18 3.81,40.64 R22.1 | v3.88,45.79 3.81,45.72 3.81,43.18 | 3.81,43.18 R23.1
  Bottom 0.5: v3.88,45.79 5.3,47.21 R_AUX.S
N$36
  Bottom 0.5: JP7.1 21.59,44.45 13.6,44.45 13.1,44.85 R_AREF.S
P0  (via drill 0.5)
  Top 0.5: PWML.1 v65,48.9
  Bottom 0.5: v65,48.9 JP2.16
P1  (via drill 0.5)
  Top 0.5: PWML.2 v62.1,48.9
  Bottom 0.5: v62.1,48.9 JP2.14
P2  (via drill 0.5)
  Top 0.5: R14.1 58.42,42.08 59.69,42.08 59.69,46.99 v59.6,48.9 PWML.3
  Bottom 0.5: v59.6,48.9 JP2.12
P3  (via drill 0.5)
  Top 0.5: R16.1 55.88,41.98 54.61,41.95 54.61,46.99 v54.6,48.9 PWML.4
  Bottom 0.5: v54.6,48.9 JP2.10
P4  (via drill 0.5)
  Top 0.5: PWML.5 v52.2,48.9
  Bottom 0.5: v52.2,48.9 JP2.8
P5  (via drill 0.5)
  Top 0.5: R18.1 50.6,43.18 49.53,43.65 49.53,46.99 v49.5,48.9 PWML.6
  Bottom 0.5: v49.5,48.9 JP2.6
P6  (via drill 0.5)
  Top 0.5: R19.1 48.36,42.18 46.99,42.25 46.99,46.99 v47.1,48.9 PWML.7
  Bottom 0.5: v47.1,48.9 JP2.4
P7  (via drill 0.5)
  Top 0.5: PWML.8 v45,48.9
  Bottom 0.5: v45,48.9 JP2.2
P8  (via drill 0.5)
  Top 0.5: JP6.10 v42.6,48.9
  Bottom 0.5: v42.6,48.9 JP1.12
P9  (via drill 0.5)
  Top 0.5: R13.1 32,25.12 32,40.3 34.1,42.4 41.9,42.4 44,44.8 44,51.5 42.9,52.5 39.8,52.5 39.12,52.02 JP6.9 v40,48.9
  Bottom 0.5: v40,48.9 JP1.10
P10  (via drill 0.5)
  Top 0.5: 36.7,50.8 36.8,50.7 v37.6,48.9 | 36.7,50.8 36.7,51.4 35.6,52.6 20.9,52.6 20.1,51.7 20.1,48.7 18.2,46.8 v18.2,43 | v28.3,41.5 28.3,40.4 R1.1 | 36.7,50.8 JP6.8 | 36.83,50.8 36.7,50.8
  Bottom 0.5: v18.2,43 19.7,41.5 v28.3,41.5 | v37.6,48.9 JP1.8
P11  (via drill 0.5)
  Top 0.5: JP6.7 34.29,50.8 v35,48.9
  Bottom 0.5: v35,48.9 JP1.6
P12  (via drill 0.5)
  Top 0.5: JP6.6 31.75,50.8 v32.5,48.9
  Bottom 0.5: v32.5,48.9 JP1.4
P13  (via drill 0.5)
  Top 0.5: JP6.5 v29.9,48.9
  Bottom 0.5: v29.9,48.9 JP1.2
SIGNAL
  Top 0.5: RS.1 29.21,11.43 29.21,10.22 JP_SIGNAL.1
SP5  (via drill 0.41)
  Top 0.5: 53.34,22.86 53.34,24.13 IC2.9 | v53.34,19.05 53.34,22.86 | 53.34,22.86 IC2.8
  Bottom 0.5: v53.34,19.05 62.23,19.05 63.5,17.78 JP4.4
SP6  (via drill 0.41)
  Top 0.5: 53.34,30.48 53.34,29.21 IC2.13 | 53.34,30.48 52.67,30.48 v52.67,32.7 | v39.37,18.88 v39.37,32.7 | 53.34,30.48 IC2.14
  Bottom 0.5: v39.37,32.7 39.37,33.17 39.6,33.4 52.4,33.4 52.6,33.2 v52.67,32.7 | v39.37,18.88 51.33,18.88 52.77,20.32 62.43,20.32 64.97,17.78 66.04,17.78 JP4.6
SPSUPER  (via drill 0.41)
  Top 0.5: 36.83,30.48 R20.2 36.8,31.22 36.8,23 37.2,21.8 37.2,18.3 37.9,17.6 41.3,17.6 44.7,21 48.2,21 48.26,20.94 v48.26,20.32 48.26,22.86 IC2.7
  Bottom 0.5: v48.26,20.32 50.8,20.32 52.07,21.59 62.83,21.59 64.72,19.7 66.5,19.7 67.4,18.8 68.37,17.73 JP4.8
TRIANG_ATE  (via drill 0.41)
  Top 0.5: IC1.14 24.13,24.13 22.86,24.13 IC1.13 22.86,22.86 v22.86,12.7 | v55.88,22.86 v55.88,12.7
  Bottom 0.5: v55.88,12.7 v22.86,12.7 | v55.88,22.86 62.23,22.86 62.27,22.9 63.4,22.9 65.2,21.1 69.7,21.1 70.91,19.89 70.91,18.6 | 70.91,18.6 JP4.10 | JP4.12 73.5,17.32 73.5,18.5 73.4,18.6 70.91,18.6
TRIANGULAR  (via drill 0.41)
  Top 0.5: v67.31,34.29 67.31,40.64 RA1.1 | IC1.9 17.98,24.03 18,24.35 18,25.9 16.51,27.39 16.51,27.94 IC1.7 16.51,29.21 16.51,30.48 11.43,30.48 C1.2 11.81,29.94 v11.81,27.87
  Bottom 0.5: v67.31,34.29 60.96,27.94 12.75,27.94 12.68,27.87 v11.81,27.87
VSET_VCO  (via drill 0.41)
  Top 0.5: IC_ATE1.6 63.67,8.59 63.67,7.32 IC_ATE1.7 62.2,7.32 v60.16,10.16 | v19.05,11.43 19.05,13.97 R5.1
  Bottom 0.5: v19.05,11.43 49.53,11.43 50.8,10.16 v60.16,10.16

### Text on the board
Top: aux | AREF | sq | 5 | S | tr | gnd | 6 | trig | vco
tPlace: 9 | 8 | 7 | 6 | 5 | 4 | 3 | 2 | 1 | 0 | 22 | 14 | 15 | 16 | 17 | 18 | 19 | 20 | 21 | 13 | 12 | 11 | 10 | 24 | 26 | 28 | 30 | 31 | 32 | 33 | 34 | 35 | 36 | 37 | 38 | 39 | 40 | 41 | 42 | 43 | www.arduino.cc | 44 | 45 | 46 | 47 | TM | 48 | 49 | 50 | 51 | 52 | 53 | 0 | 1 | 2 | 3 | 4 | 5 | 6 | 7 | 8 | 9 | 10 | 11 | 12 | 13 | 14 | 15
tNames: SCL | SDA | 5V | GND | AREF | 1 | GND | IOREF | RESET | 3V3 | 5V | GND | VIN
bNames: MADE IN | designed by | ITALY | tinker it